# Altium schematic sheet Hedgehog.SchDoc
size A3
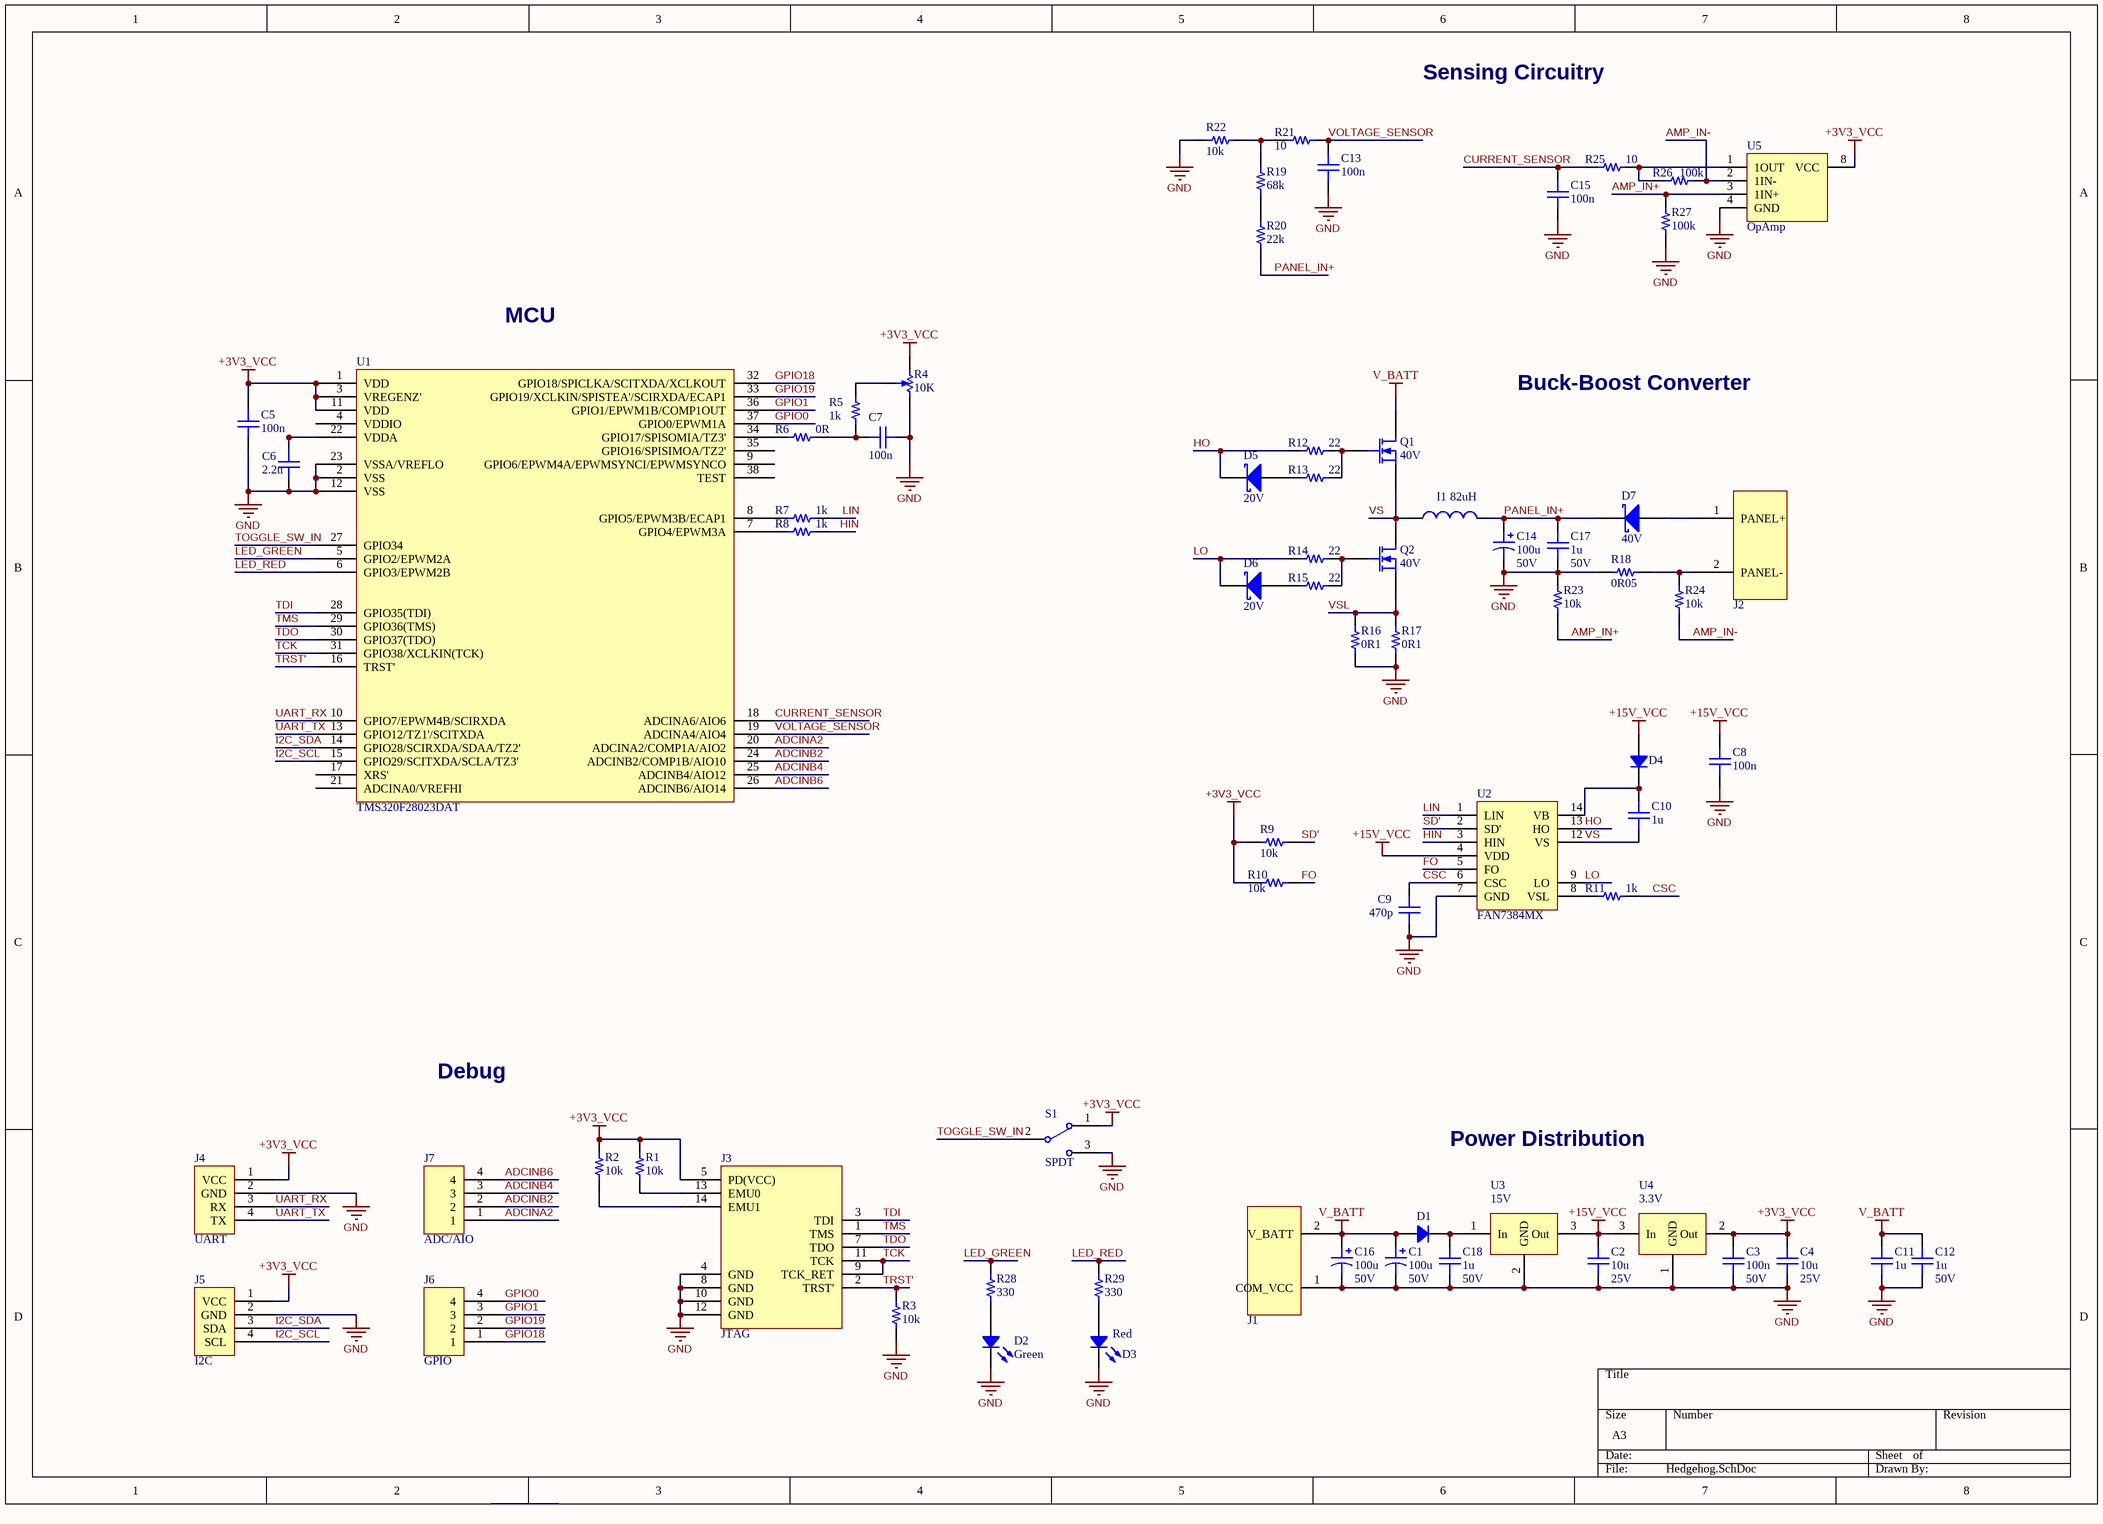
[diagram p0: Hedgehog.SchDoc]

## Parts
C1  100u  VoltageRating: 50V  [CAP-100uF-50V-20%-THM-Radial Panasonic Electronic Components]
C2  10u  VoltageRating: 25V  [CAP 1206/3216 Murata]
C3  100n  VoltageRating: 50V  [CAP 0805/2012]
C4  10u  VoltageRating: 25V  [CAP 1206/3216 Murata]
C5  100n  [CAP 0805/2012]
C6  2.2u  [CAP 0805/2012]
C7  100n  [CAP 0805/2012]
C8  100n  [CAP 0805/2012]
C9  470p  [CAP 0805/2012]
C10  1u  [CAP 0805/2012]
C11  1u  [CAP-TH-Radial_1uF-Non_Polarised-KEMET]
C12  1u  VoltageRating: 50V  [CAP 1206/3216 Murata]
C13  100n  [CAP 0805/2012]
C14  100u  VoltageRating: 50V  [CAP-100uF-50V-20%-THM-Radial Panasonic Electronic Components]
C15  100n  [CAP 0805/2012]
C16  100u  VoltageRating: 50V  [CAP-100uF-50V-20%-THM-Radial Panasonic Electronic Components]
C17  1u  VoltageRating: 50V  [CAP 1206/3216 Murata]
C18  1u  VoltageRating: 50V  [CAP 1206/3216 Murata]
D1  400V-1A-GenPurp-SMA  [SMA Diodes Incorporated]  (value not drawn)
D2  Color: Green  [LED 1206/3216 Kingbright]  (hidden comment: LED-Green-1206)
D3  Color: Red  [LED 1206/3216 Kingbright]  (hidden comment: LED-Red-1206)
D4  400V-2A-Fast-SMA  [SMA Diodes Incorporated]  (value not drawn)
D5  VoltageRating: 20V  [CFP3-SOD123W-Nexperia USA Inc.]  (hidden comment: 20V-1A-SCHOTTKY-SOD123W)
D6  VoltageRating: 20V  [CFP3-SOD123W-Nexperia USA Inc.]  (hidden comment: 20V-1A-SCHOTTKY-SOD123W)
D7  VoltageRating: 40V  [DIOM6959X25L]  (hidden comment: 40V-5A-SCHOTTKY-SMC)
I1  82uH  [Inductor-82uH-Pulse Electronics Power]
J1  (no value)  [TWO_PIN_CONNECTOR-15A-On Shore Technology Inc.]
J2  (no value)  [TWO_PIN_CONNECTOR-15A-On Shore Technology Inc.]
J3  JTAG  [14Pin-Connector-2.54mmx2.54mmPitch On Shore Technology Inc.]
J4  I2C  [4Pin_Connector-Wurth Electronics Inc.]
J5  UART  [4Pin_Connector-Wurth Electronics Inc.]
J6  GPIO  [4Pin_Connector-Wurth Electronics Inc.]
J7  ADC/AIO  [4Pin_Connector-Wurth Electronics Inc.]
Q1  40V  [DPAK/TO252-3-5.46mmWidth(Tab) ON Semiconductor - VIAS]
Q2  40V  [DPAK/TO252-3-5.46mmWidth(Tab) ON Semiconductor - VIAS]
R1  10k  [RES 0805/2012]
R2  10k  [RES 0805/2012]
R3  10k  [RES 0805/2012]
R4  10K  [Potentiometer-TC33X-2-103E-Bourns Inc.]
R5  1k  [RES 0805/2012]
R6  0R  [RES 0805/2012]
R7  1k  [RES 0805/2012]
R8  1k  [RES 0805/2012]
R9  10k  [RES 0805/2012]
R10  10k  [RES 0805/2012]
R11  1k  [RES 0805/2012]
R12  22  [RES 0805/2012]
R13  22  [RES 0805/2012]
R14  22  [RES 0805/2012]
R15  22  [RES 0805/2012]
R16  0R1  [RES 2512/6432]
R17  0R1  [RES 2512/6432]
R18  0R05  [RES 2512/6432]
R19  68k  [RES 0805/2012]
R20  22k  [RES 0805/2012]
R21  10  [RES 0805/2012]
R22  10k  [RES 0805/2012]
R23  10k  [RES 0805/2012]
R24  10k  [RES 0805/2012]
R25  10  [RES 0805/2012]
R26  100k  [RES 0805/2012]
R27  100k  [RES 0805/2012]
R28  330  [RES 0805/2012]
R29  330  [RES 0805/2012]
S1  SPDT  [Toggle_Switch-SPDT-C&K]
U1  TMS320F28023DAT
U2  FAN7384MX  [14SOIC-3.9mmWidth ON Semiconductor]
U3  15V  [DPAK/TO252-3-5.46mmWidth(Tab) ON Semiconductor]
U4  OutputVoltage: 3.3V  [SOT223/TO261-4 Diodes Incorporated]  (hidden comment: Voltage Regulator)
U5  OpAmp  [8SOIC-3.9mmWidth]

## Nets
+3V3_VCC: C3.2 C4.1 C5.2 J3.5(PD(VCC)) J4.1(VCC) J5.1(VCC) R1.2 R2.2 R4.3(CW) R9.1 R10.1 S1.1 U1.1(VDD) U1.3(VREGENZ') U1.11(VDD) U4.2(Out) U5.8(VCC)
+15V_VCC: C2.1 C8.1 D4.1 U2.4(VDD) U3.3(Out) U4.3(In)
GND: C1.2 C2.2 C3.1 C4.2 C5.1 C6.1 C7.1 C8.2 C9.1 C11.1 C12.1 C13.1 C14.2 C15.2 C16.2 C17.1 C18.1 D2.2 D3.2 J1.1(COM_VCC) J3.4(GND) J3.8(GND) J3.10(GND) J3.12(GND) J4.2(GND) J5.2(GND) R3.1 R4.1(CCW) R16.1 R17.1 R18.1 R22.2 R23.2 R27.2 S1.3 U1.2(VSS) U1.12(VSS) U1.23(VSSA/VREFLO) U2.7(GND) U3.2(GND) U4.1(GND) U5.4(GND)
V_BATT: C1.1 C11.2 C12.2 C16.1 D1.1 J1.2(V_BATT) Q1.2(D)
ADCINA2: J7.1 U1.20(ADCINA2/COMP1A/AIO2)
ADCINB2: J7.2 U1.24(ADCINB2/COMP1B/AIO10)
ADCINB4: J7.3 U1.25(ADCINB4/AIO12)
ADCINB6: J7.4 U1.26(ADCINB6/AIO14)
AMP_IN+: R23.1 R27.1 U5.3(1IN+)
AMP_IN-: R24.1 R26.2 U5.2(1IN-)
CSC: C9.2 R11.1 U2.6(CSC)
CURRENT_SENSOR: C15.1 R25.2 U1.18(ADCINA6/AIO6)
FO: R10.2 U2.5(FO)
GPIO0: J6.4 U1.37(GPIO0/EPWM1A)
GPIO1: J6.3 U1.36(GPIO1/EPWM1B/COMP1OUT)
GPIO18: J6.1 U1.32(GPIO18/SPICLKA/SCITXDA/XCLKOUT)
GPIO19: J6.2 U1.33(GPIO19/XCLKIN/SPISTEA'/SCIRXDA/ECAP1)
HIN: R8.2 U2.3(HIN)
HO: D5.2(K) R12.1 U2.13(HO)
I2C_SCL: J5.4(SCL) U1.15(GPIO29/SCITXDA/SCLA/TZ3')
I2C_SDA: J5.3(SDA) U1.14(GPIO28/SCIRXDA/SDAA/TZ2')
LED_GREEN: R28.2 U1.5(GPIO2/EPWM2A)
LED_RED: R29.2 U1.6(GPIO3/EPWM2B)
LIN: R7.2 U2.1(LIN)
LO: D6.2(K) R14.1 U2.9(LO)
PANEL_IN+: C14.1 C17.2 D7.2(K) I1.2 R20.1
SD': R9.2 U2.2(SD')
TCK: J3.9(TCK_RET) J3.11(TCK) U1.31(GPIO38/XCLKIN(TCK))
TDI: J3.3(TDI) U1.28(GPIO35(TDI))
TDO: J3.7(TDO) U1.30(GPIO37(TDO))
TMS: J3.1(TMS) U1.29(GPIO36(TMS))
TOGGLE_SW_IN: S1.2 U1.27(GPIO34)
TRST': J3.2(TRST') R3.2 U1.16(TRST')
UART_RX: J4.3(RX) U1.10(GPIO7/EPWM4B/SCIRXDA)
UART_TX: J4.4(TX) U1.13(GPIO12/TZ1'/SCITXDA)
VOLTAGE_SENSOR: C13.2 R21.2 U1.19(ADCINA4/AIO4)
VS: C10.1 I1.1 Q1.3(S) Q2.2(D) U2.12(VS)
VSL: Q2.3(S) R16.2 R17.2
NetC6_2: C6.2 U1.22(VDDA)
NetC7_2: C7.2 R5.1 R6.2
NetC10_2: C10.2 D4.2 U2.14(VB)
NetC18_2: C18.2 D1.2 U3.1(In)
NetD2_1: D2.1 R28.1
NetD3_1: D3.1 R29.1
NetD5_1: D5.1(A) R13.1
NetD6_1: D6.1(A) R15.1
NetD7_1: D7.1(A) J2.1(PANEL+)
NetJ2_2: J2.2(PANEL-) R18.2 R24.2
NetJ3_13: J3.13(EMU0) R1.1
NetJ3_14: J3.14(EMU1) R2.1
NetQ1_1: Q1.1(G) R12.2 R13.2
NetQ2_1: Q2.1(G) R14.2 R15.2
NetR4_2: R4.2(W) R5.2
NetR6_1: R6.1 U1.34(GPIO17/SPISOMIA/TZ3')
NetR7_1: R7.1 U1.8(GPIO5/EPWM3B/ECAP1)
NetR8_1: R8.1 U1.7(GPIO4/EPWM3A)
NetR11_2: R11.2 U2.8(VSL)
NetR19_1: R19.1 R20.2
NetR19_2: R19.2 R21.1 R22.1
NetR25_1: R25.1 R26.1 U5.1(1OUT)

Not connected (* = marked no-connect by the designer): J3 6(N/C); U1 4(VDDIO) 9(GPIO6/EPWM4A/EPWMSYNCI/EPWMSYNCO) 17(XRS') 21(ADCINA0/VREFHI) 35(GPIO16/SPISIMOA/TZ2') 38(TEST); U2 10(NC) 11(NC); U5 5(2IN+) 6(2IN-) 7(2OUT)

## Notes on the sheet
- Sensing Circuitry
- MCU
- Buck-Boost Converter
- Debug
- Power Distribution

## Library data of the parts
C1 C14 C16 = 100u-50V-THM-Radial-20%: Polarized Capacitor, 100uF, 50V Voltage Rating, Through Hole Radial Package; ManufacturerReference: ECA-1HM101; ManufacturerName: Panasonic Electronic Components; Other: 20%, 2000hr, 85C; Material: Alum; PackageReference: Through Hole Radial-3.5mmLeadSpacing; DistributorReference: P5182-ND; DistributorName: Digikey; Value: 100uF; InventoryNumber: *; Category: Capacitor Polarized
C2 C4 = 10u-25V-1206-10%: Capacitor, 10uF, 25V Voltage Rating, 1206 Package; ManufacturerReference: GRM31CR61E106KA12L; ManufacturerName: Murata; InventoryNumber: CAP113; Material: MLCC; Other: 10%, X5R; PackageReference: 1206; DistributorReference: 490-3373-1-ND; DistributorName: Digikey; Value: 10uF; Category: Capacitor
C3 C5 C7 C8 C13 C15 = 100n-50V-0805-10%: Capacitor, 100nF, 50V Voltage Rating, 0805 Package; InventoryNumber: CAP033; Material: MLCC; Other: 10%, X7R; PackageReference: 0805; DistributorReference: 478-1395-1-ND; DistributorName: Digikey; Value: 100nF; Category: Capacitor
C6 = 2.2u-25V-0805-10%: Capacitor, 2.2uF, 25V Voltage Rating, 0805 Package; InventoryNumber: CAP102; Material: MLCC; Other: 10%, X7R; DistributorReference: 490-3331-1-ND; PackageReference: 0805; DistributorName: Digikey; Value: 2.2uF; Category: Capacitor; VoltageRating: 25V
C9 = 470p-50V-0805-5%: Capacitor, 470pF, 50V Voltage Rating, 0805 Package; InventoryNumber: CAP014; Material: MLCC; Other: 5%,C0G; DistributorReference: 709-1179-1-ND; PackageReference: 0805; DistributorName: Digikey; Value: 470pF; Category: Capacitor; VoltageRating: 50V
C10 = 1u-25V-0805-10%: Capacitor,1uF, 25V Voltage Rating, 0805 Package; InventoryNumber: CAP052; Material: MLCC; Other: 10%, X7R; DistributorReference: 445-1354-1-ND; PackageReference: 0805; DistributorName: Digikey; Value: 1uF; Category: Capacitor; VoltageRating: 25V
C11 = 1u-63V-THM-Radial-10%: Capacitor, 1uF, 63V Voltage Rating, RADIAL Package; ManufacturerReference: R82DC4100AA60J; ManufacturerName: KEMET; Material: Polyester; Other: 5%; PackageReference: TH-RADIAL-7.2X5.0mm-5mmPitch; DistributorReference: 399-5860-ND; DistributorName: Digikey; InventoryNumber: *; Value: 1uF; Category: Capacitor; VoltageRating: 63V
C12 C17 C18 = 1u-50V-1206-10%: Capacitor, 1uF, 50V Voltage Rating, 1206 Package; ManufacturerReference: C3216X7R1H105K160AB; ManufacturerName: TDK Corporation; InventoryNumber: CAP053; Material: MLCC; Other: 10%, X7R; PackageReference: 1206; DistributorReference: 445-1423-1-ND; DistributorName: Digikey; Value: 1uF; Category: Capacitor
D1 = 400V-1A-GenPurp-SMA: Diode, 400V Voltage Rating, 1A Current Rating, General Purpose Type, SMA Package; Manufacturer: ON Semiconductor; ManufacturerReference: MRA4004T3G; InventoryNumber: DIODE043; PackageReference: SMA; Distributor: Digikey; DistributorReference: MRA4004T3GOSCT-ND; Type: General Purpose; VoltageRating: 400V
D2 = LED-Green-1206: LED, Green Color, 1206 Package; Manufacturer: Kingbright; ManufacturerReference: APT3216SGC; InventoryNumber: DIODE004; PackageReference: 1206; Distributor: Digikey; DistributorReference: 754-1141-1-ND; Type: LED
D3 = LED-Red-1206: LED, Red Color, 1206 Package; Manufacturer: Kingbright; ManufacturerReference: APT3216SRCPRV; InventoryNumber: DIODE001; PackageReference: 1206; Distributor: Digikey; DistributorReference: 754-1142-1-ND; Type: LED
D4 = 400V-2A-Fast-SMA: Diode, 400V Voltage Rating, 2A Current Rating, Fast Type, SMA Package; Manufacturer: ON Semiconductor; ManufacturerReference: MURA240T3G; InventoryNumber: DIODE050; PackageReference: SMA; Distributor: Digikey; DistributorReference: MURA240T3GOSCT-ND; Type: Fast; VoltageRating: 400V
D5 D6 = 20V-1A-SCHOTTKY-SOD123W: Diode, 20V Voltage Rating, 1A Current Rating, SCHOTTKY Type, SOD123W Package; Manufacturer: Nexperia USA Inc.; ManufacturerReference: PMEG2010ER,115; PackageReference: CFP3-SOD123W; Distributor: Digikey; DistributorReference: 1727-5192-1-ND; InventoryNumber: *; Type: SCHOTTKY
D7 = 40V-5A-SCHOTTKY-SMC: Diode, 40V Voltage Rating, 5A Current Rating, SCHOTTKY Type, SMC Package; Manufacturer: Diodes Incorporated; ManufacturerReference: B540C-13-F; PackageReference: SMC; Distributor: Digikey; DistributorReference: B540C-FDICT-ND; InventoryNumber: *; Type: SCHOTTKY
I1 = 82uH-6.5A-83mOhm: 82u, 6.5A Current Rating, 83mOhm Resistance, ThroughHole Package; ManufacturerName: Pulse Electronics Power; ManufacturerReference: PA4344.823ANLT; Other: 20%; Category: Inductor; DistributorName: Digikey; DistributorReference: 553-4038-1-ND; InventoryNumber: *; Resistance: 83mOhm; PackageReference: *; Value: 82uH; CurrentRating: 6.5A
J1 J2 = TwoPin-Connector-15A-300V-THM: Slide Toggle Switch, 300V Voltage Rating, 15A Current Rating,; Manufacturer: On Shore Technology Inc.; ManufacturerReference: OSTTA024163; InventoryNumber: SC037; Distributor: Digikey; DistributorReference: ED2580-ND; CurrentRating: 15A; VoltageRating: 300V; Package: 5.08mmPitch
J3 = 14Pin-Connector: Manufacturer: On Shore Technology Inc.; ManufacturerReference: 302-S141; InventoryNumber: SC043; VoltageRating: 250V; CurrentRating: 3A; Distributor: Digikey; DistributorReference: ED10522-ND
J4-J7 = 4Pin-Connector: Distributor: Digikey; DistributorReference: *; Manufacturer: *; ManufacturerReference: *; InventoryNumber: *; VoltageRating: *; CurrentRating: *
Q1 Q2 = Mosfet-40V-6A-1.71W-SMD-DPAK: N-CH, 40V Voltage Rating, 6A Current Rating,  1.71W Power Rating, DPAK Package; Manfacturer: Diodes Incorporated; Material: METAL OXIDE; Type: N-Channel; DistributorName: Digikey; DistributorReference: DMN4040SK3-13DICT-ND; ManufacturerReference: Diodes Incorporated; VoltageRating: 40V; CurrentRating: 6A; Package: DPAK/TO252-3; PowerRating: 1.71W; InventoryNumber: *
R1 R2 R22-R24 = 10k-125mW-0805-1%: Resistor, 10k, 125mW Power Rating, 0805 Package; ManufacturerReference: MCR10EZPF1002; InventoryNumber: RES038; Value: 10k Ohm; PowerRating: 125mWatt; Other: 1%; DistributorName: Digikey; DistributorReference: RHM10.0KCRCT-ND; PackageReference: 0805; Category: Resistor
R3 R9 R10 = 10k-125mW-0805-1%: Resistor, 10k, 125mW Power Rating, 0805 Package; ManufacturerReference: MCR10EZPF1002; Value: 10k Ohm; InventoryNumber: RES038; PowerRating: 125mWatt; Other: 1%; DistributorReference: RHM10.0KCRCT-ND; PackageReference: 0805; DistributorName: Digikey; Category: Resistor
R4 = Pot-10kOhm-0.1W-20%: Potentiometer, 10kOhm Resistance, Current Rating, 0.1W Power Rating; Manufacturer: Bourns Inc.; ManufacturerReference: TC33X-2-103E; PowerRating: .1W; Other: 25%; Distributor: Digikey; DistributorReference: TC33X-103ECT-ND; Value: 10K; CurrentRating: *; Package: *; InventoryNumber: *
R5 R7 R8 R11 = 1k-125mW-0805-1%: Resistor, 1k, 125mW Power Rating, 0805 Package; ManufacturerReference: MCR10EZHF1001; Value: 1k Ohm; InventoryNumber: RES020; PowerRating: 125mWatt; Other: 1%; DistributorReference: RHM1.00KCCT-ND; PackageReference: 0805; DistributorName: Digikey; Category: Resistor
R6 = 0k-125mW-0805-Jumper: Resistor, 0 , 125mW Power Rating, 0805 Package; ManufacturerReference: MCR10EZPJ000; InventoryNumber: RES001; Value: 0 Ohm; PowerRating: 125mWatt; Other: JUMPER; DistributorName: Digikey; DistributorReference: RHM0.0ARCT-ND; PackageReference: 0805; Category: Resistor
R12-R15 = 22-125mW-0805-1%: Resistor, 22, 125mW Power Rating, 0805 Package; ManufacturerReference: RC0805FR-0722RL; InventoryNumber: RES007; Value: 22 Ohm; PowerRating: 125mWatt; Other: 1%; DistributorName: Digikey; DistributorReference: 311-22.0CRCT-ND; PackageReference: 0805; Category: Resistor
R16 R17 = RES-0.1-1W-SMD-2010-1%: Resistor, 0.1 Ohm, 1W Power Rating, 2010 Package; ManufacturerName: Stackpole Electronics Inc.; ManufacturerReference: CSRN2010FKR100; Value: 0.1 Ohm; PowerRating: 1 Watt; Other: 1%; DistributorName: Digikey; DistributorReference: CSRN2010FKR100CT-ND; InventoryNumber: *; PackageReference: 2010 (5025); Category: Resistor
R18 = RES-0.05-3W-SMD-2512-1%: Resistor, 0.05 Ohm, 3W Power Rating, 2512 Package; ManufacturerName: Bourns Inc.; ManufacturerReference: CRA2512-FZ-R050ELF; PowerRating: 3Watt; Other: 1%; DistributorName: Digikey; DistributorReference: CRA2512-FZ-R050ELFCT-ND; InventoryNumber: *; Value: 0.05 Ohm; PackageReference: 2512; Category: Resistor
R19 = 68k-125mW-0805-1%: Resistor, 68k, 125mW Power Rating, Package; ManufacturerReference: MCR10EZPF6802; InventoryNumber: RES050; Value: 68k Ohm; Other: 5%; DistributorName: Digikey; DistributorReference: RHM68.0KCRTR-ND; PowerRating: 125mW; PackageReference: 0805; Category: Resistor
R20 = 22k-125mW-0805-1%: Resistor, 22k, 125mW Power Rating, 0805 Package; ManufacturerReference: RMCF0805FT22K0; InventoryNumber: RES044; Value: 22k Ohm; PowerRating: 125mWatt; Other: 1%; DistributorName: Digikey; DistributorReference: RMCF0805FT22K0CT-ND; PackageReference: 0805; Category: Resistor
R21 R25 = 10-125mW-0805-1%: Resistor, 10, 125mW Power Rating, 0805 Package; ManufacturerReference: MCR10EZHF10R0; InventoryNumber: RES005; Value: 10 Ohm; PowerRating: 125mWatt; Other: 1%; DistributorName: Digikey; DistributorReference: RHM10.0CCT-ND; PackageReference: 0805; Category: Resistor
R26 R27 = 100k-125mW-0805-1%: Resistor, 100k, 125mW Power Rating, 0805 Package; ManufacturerReference: MCR10EZPF1003; InventoryNumber: RES052; Value: 100k Ohm; PowerRating: 125mWatt; Other: 1%; DistributorName: Digikey; DistributorReference: RHM100KCRCT-ND; PackageReference: 0805; Category: Resistor
R28 R29 = 330-125mW-0805-1%: Resistor, 330, 125mW Power Rating, 0805 Package; ManufacturerReference: MCR10EZPF3300; Value: 330 Ohm; InventoryNumber: RES014; PowerRating: 125mWatt; Other: 1%; DistributorReference: RHM330CRCT-ND; PackageReference: 0805; DistributorName: Digikey; Category: Resistor
S1 = ToggleSwitch-SPDT-12V-100mA: Slide Toggle Switch, 12V Voltage Rating, 100mA Current Rating, Through Hole Package; Manufacturer: C&K; ManufacturerReference: OS102011MS2QN1; Distributor: Digikey; DistributorReference: CKN9565-ND; CurrentRating: 100mA; VoltageRating: 12V; Package: *; InventoryNumber: *; Circuit: SPDT
U1 = MC-TMS320F28023DAT_Modified: IC MCU 32BIT 64KB FLASH 38TSSOP; Manufacturer: Texas Instruments; Distributor: Digikey; DistributorReference: 296-27220-ND; ManufacturerReference: TMS320F28023DAT; InventoryNumber: *; Package: 38TSSOP-6.1mmWidth
U2 = FAN7384MX: Half-Bridge Gate Driver IC Non-Inverting 14-SOIC; Manufacturer: ON Semiconductor; InventoryNumber: IC103; Distributor: Digikey; DistributorReference: FAN7384MXCT-ND; PackageReference: 14-SOIC-3.9mmWidth; ManufacturerReference: FAN7384MX
U3 = 15V-1A-LDO-SMD-DPAK: Voltage Regulator, 15V OutputVoltage, 1A MaxCurrent, LDO Type, DPAK Package; Manufacturer: ON Semiconductor; ManufacturerReference: MC7815CDTG; InputVoltageRating: 35V; Distributor: Digikey; DistributorReference: MC7815CDTGOS-ND; InventoryNumber: *; Type: LDO; CurrentRating: 1A; Package: DPAK/TO252-3; OutputVoltage: 15V
U4 = 3.3V-1A-LDO-SMD-SOT223_2: Voltage Regulator, 3.3V OutputVoltage, 1A MaxCurrent, LDO Type, SOT223 Package; Manufacturer: Diodes Incorporated; ManufacturerReference: ZLDO1117G33TA; InventoryNumber: IC013; InputVoltageRating: 18V; Distributor: Digikey; DistributorReference: ZLDO1117G33DICT-ND; Type: LDO; CurrentRating: 1A; Package: SOT223/TO261-4
U5 = LM358AD: IC OPAMP GP 700KHZ 8SOIC; Manufacturer: Texas Instruments; InventoryNumber: IC212; Distributor: Digikey; DistributorReference: 296-9553-5-ND; PackageReference: 8SOIC-3.9mmWidth; ManufacturerReference: LM358AD